# Altium schematic sheet Header-Male-2.54_2x20.schdoc
size 127 x 101 mm
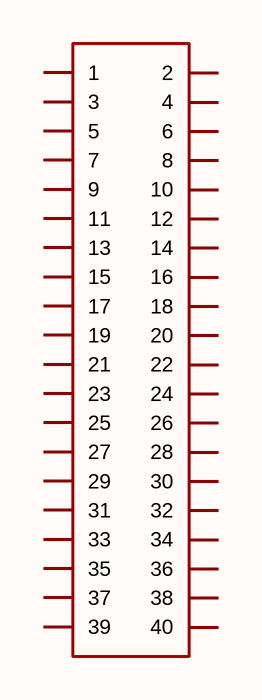
[diagram p0: Header-Male-2.54_2x20.schdoc]

## Parts
H?  2.54mm 2*20p直排针  [HDR-TH_40P-P2.54-V-M-R2-C20-S2.54]  (value not drawn)

## Nets

Not connected (* = marked no-connect by the designer): H? 1 2 3 4 5 6 7 8 9 10 11 12 13 14 15 16 17 18 19 20 21 22 23 24 25 26 27 28 29 30 31 32 33 34 35 36 37 38 39 40

## Library data of the parts
H? = 2.54mm 2*20p直排针: 插针结构:2x20P;间距:2.54mm;行距:2.54mm;圆针/方针:方针;安装方式:直插;排数:双排;总PIN位数:40P;额定电流:3A;额定电压:-;配合针长度:6mm;塑高:-;端接针长度:3mm;触头材质:黄铜;触头镀层:-;工作温度:-40℃~+105℃;颜色:黑色;; Manufacturer: BOOMELE(博穆精密); Symbol: Header-Male-2.54_2x20; AddInBom: yes; ModelId: 2f697d2f705a4509bdac70452e51b3cc; ModelName: HDR-TH_40P-P2.54-M-LI-2X20P; ModelTransform: 1999.996,196.85,0,0,0,0,0,0,-118.11; Pin Structure: 2x20P; Circluar Pins/Square Pins: 方针; Current Rating: 3A; LCSC Part Name: 2x20P 间距:2.54mm 方针 直插; SupplierPart: C50980; ManufacturerPart: 2.54mm 2*20P直排针; Supplier Footprint: 插件,P=2.54mm; JLCPCB Part Class: Extended Part; Datasheet: https://item.szlcsc.com/datasheet/2.54mm%25202*20P%25E7%259B%25B4%25E6%258E%2592%25E9%2592%2588/51992.html; Supplier: LCSC; ConvertToPcb: yes; FootprintName: HDR-TH_40P-P2.54-V-M-R2-C20-S2.54; Pitch: 2.54mm; Row Spacing: 2.54mm; Mounting Type: 直插; Number of Rows: 双排; Number of Pins: 40P; Voltage Rating (Max): -; Length of Mating Pin: 6mm; Insulation Height: -; Length of End Connection Pin: 3mm; Contact Material: 黄铜; Contact Plating: -; Operating Temperature: -40℃~+105℃; Color: 黑色